# EAGLE design record_revf (EAGLE 8.5.0)
Ekho Mobile Recording Front-End Board (Rev A) Provides signal conditioning, amplification, and adjustment for the I-V Controller.
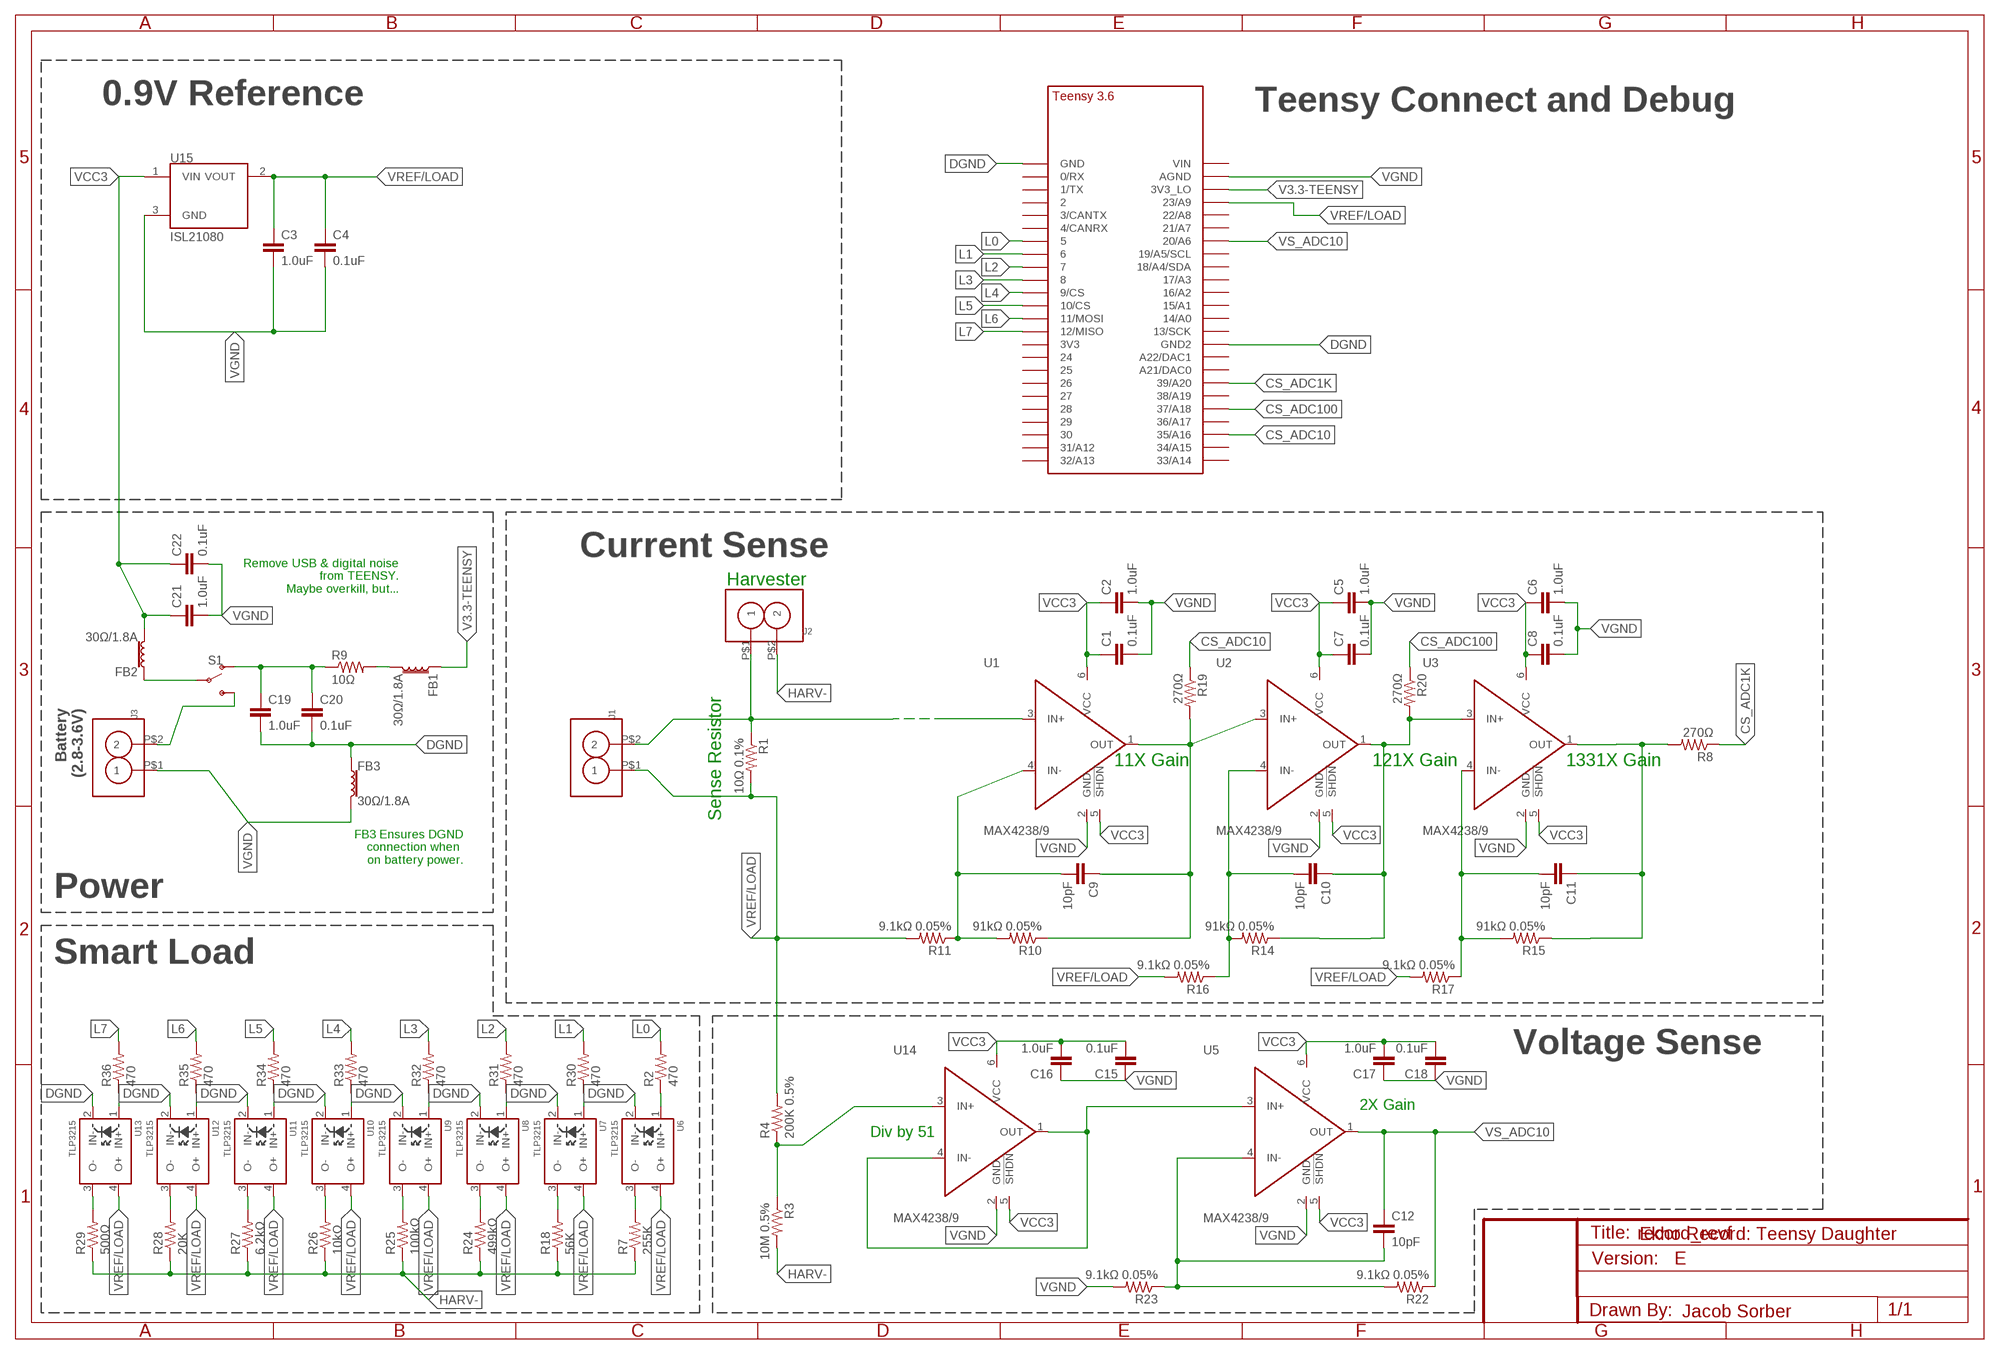
[diagram p0: schematic, sheet 1]

## Parts
C1  0.1uF  C-EU0603  [0603]
C2  1.0uF  C-EU0603  [0603]
C3  1.0uF  C-EU0603  [0603]
C4  0.1uF  C-EU0603  [0603]
C5  1.0uF  C-EU0603  [0603]
C6  1.0uF  C-EU0603  [0603]
C7  0.1uF  C-EU0603  [0603]
C8  0.1uF  C-EU0603  [0603]
C9  10pF  C-EU0603  [0603]
C10  10pF  C-EU0603  [0603]
C11  10pF  C-EU0603  [0603]
C12  10pF  C-EU0603  [0603]
C15  0.1uF  C-EU0603  [0603]
C16  1.0uF  C-EU0603  [0603]
C17  1.0uF  C-EU0603  [0603]
C18  0.1uF  C-EU0603  [0603]
C19  1.0uF  C-EU0603  [0603]
C20  0.1uF  C-EU0603  [0603]
C21  1.0uF  C-EU0603  [0603]
C22  0.1uF  C-EU0603  [0603]
FB1  30Ω/1.8A  FERRITE_BEAD-0603  [0603]
FB2  30Ω/1.8A  FERRITE_BEAD-0603  [0603]
FB3  30Ω/1.8A  FERRITE_BEAD-0603  [0603]
J1  SCREW_CONNECTOR-2PIN'  [SCREW_CONNECTOR-2PIN-3.5MM]
J2  SCREW_CONNECTOR-2PIN'  [SCREW_CONNECTOR-2PIN-3.5MM]
J3  SCREW_CONNECTOR-2PIN'  [SCREW_CONNECTOR-2PIN-3.5MM]
R1  10Ω 0.1%  RESISTOR0805-RES  [0805]
R2  470  R-EU0603  [0603]
R3  10M 0.5%  R-EU0603  [0603]
R4  200K 0.5%  R-EU0603  [0603]
R7  255K  R-EU0603  [0603]
R8  270Ω  R-EU0603  [0603]
R9  10Ω  RESISTOR0805-RES  [0805]
R10  91kΩ 0.05%  R-EU0603  [0603]
R11  9.1kΩ 0.05%  R-EU0603  [0603]
R14  91kΩ 0.05%  R-EU0603  [0603]
R15  91kΩ 0.05%  R-EU0603  [0603]
R16  9.1kΩ 0.05%  R-EU0603  [0603]
R17  9.1kΩ 0.05%  R-EU0603  [0603]
R18  56K  R-EU0603  [0603]
R19  270Ω  R-EU0603  [0603]
R20  270Ω  R-EU0603  [0603]
R22  9.1kΩ 0.05%  R-EU0603  [0603]
R23  9.1kΩ 0.05%  R-EU0603  [0603]
R24  499kΩ  R-EU0603  [0603]
R25  100kΩ  R-EU0603  [0603]
R26  10kΩ  R-EU0603  [0603]
R27  6.2kΩ  R-EU0603  [0603]
R28  20K  R-EU0603  [0603]
R29  500Ω  R-EU0603  [0603]
R30  470  R-EU0603  [0603]
R31  470  R-EU0603  [0603]
R32  470  R-EU0603  [0603]
R33  470  R-EU0603  [0603]
R34  470  R-EU0603  [0603]
R35  470  R-EU0603  [0603]
R36  470  R-EU0603  [0603]
S1  SWITCH-SPDT-PTH-11.6X4.0MM-KIT  [SWITCH_SPDT_PTH_11.6X4.0MM_KIT]
U1  MAX4238/9  [SOT23-6]
U2  MAX4238/9  [SOT23-6]
U3  MAX4238/9  [SOT23-6]
U5  MAX4238/9  [SOT23-6]
U6  TLP3215  [TLP3215]
U7  TLP3215  [TLP3215]
U8  TLP3215  [TLP3215]
U9  TLP3215  [TLP3215]
U10  TLP3215  [TLP3215]
U11  TLP3215  [TLP3215]
U12  TLP3215  [TLP3215]
U13  TLP3215  [TLP3215]
U14  MAX4238/9  [SOT23-6]
U15  ISL21080  [SOT-23]
U$6  TEENSY_3.5/3.6_SIDE_ONLY  [TEENSY_3.5/3.6_SIDE_ONLY]

## Nets
CS_ADC1K: R8.1 U$6.39/A20
CS_ADC10: R19.1 U$6.35/A16
CS_ADC100: R20.1 U$6.37/A18
DGND: C19.2 C20.2 FB3.1 U6.2(IN-) U7.2(IN-) U8.2(IN-) U9.2(IN-) U10.2(IN-) U11.2(IN-) U12.2(IN-) U13.2(IN-) U$6.GND U$6.GND2
HARV+: J1.P$2 J2.P$1 R1.1 U1.3(IN+)
HARV-: J2.P$2 R3.2 R7.1 R18.1 R24.1 R25.1 R26.1 R27.1 R28.1 R29.1
L0: R2.2 U$6.5
L1: R30.2 U$6.6
L2: R31.2 U$6.7
L3: R32.2 U$6.8
L4: R33.2 U$6.9/CS
L5: R34.2 U$6.10/CS
L6: R35.2 U$6.11/MOSI
L7: R36.2 U$6.12/MISO
N$1: C9.2 R10.2 R11.1 U1.4(IN-)
N$2: R3.1 R4.1 U14.3(IN+)
N$4: U5.3(IN+) U14.1(OUT) U14.4(IN-)
N$6: C19.1 C20.1 R9.1 S1.1(O)
N$7: FB1.2 R9.2
N$9: R29.2 U13.3(O-)
N$10: J3.P$2 S1.3(S)
N$11: C12.2 R22.2 R23.1 U5.4(IN-)
N$13: FB2.1 S1.2(P)
N$14: R28.2 U12.3(O-)
N$16: R27.2 U11.3(O-)
N$18: C10.2 R14.2 R16.1 U2.4(IN-)
N$19: C11.2 R15.2 R17.1 U3.4(IN-)
N$21: R26.2 U10.3(O-)
N$24: R25.2 U9.3(O-)
N$25: R24.2 U8.3(O-)
N$26: R18.2 U7.3(O-)
N$27: R7.2 U6.3(O-)
N$28: R2.1 U6.1(IN+)
N$29: R30.1 U7.1(IN+)
N$30: R31.1 U8.1(IN+)
N$31: R32.1 U9.1(IN+)
N$32: R33.1 U10.1(IN+)
N$33: R34.1 U11.1(IN+)
N$34: R35.1 U12.1(IN+)
N$35: R36.1 U13.1(IN+)
OUT1K: C11.1 R8.2 R15.1 U3.1(OUT)
OUT10: C9.1 R10.1 R19.2 U1.1(OUT) U2.3(IN+)
OUT100: C10.1 R14.1 R20.2 U2.1(OUT) U3.3(IN+)
V3.3-TEENSY: FB1.1 U$6.3V3_LO
VCC3: C1.1 C2.1 C5.1 C6.1 C7.1 C8.1 C15.2 C16.2 C17.2 C18.2 C21.1 C22.1 FB2.2 U1.5(!SHDN) U1.6(VCC) U2.5(!SHDN) U2.6(VCC) U3.5(!SHDN) U3.6(VCC) U5.5(!SHDN) U5.6(VCC) U14.5(!SHDN) U14.6(VCC) U15.1(VIN)
VGND: C1.2 C2.2 C3.2 C4.2 C5.2 C6.2 C7.2 C8.2 C15.1 C16.1 C17.1 C18.1 C21.2 C22.2 FB3.2 J3.P$1 R23.2 U1.2(GND) U2.2(GND) U3.2(GND) U5.2(GND) U14.2(GND) U15.3(GND) U$6.AGND
VREF/LOAD: C3.1 C4.1 J1.P$1 R1.2 R4.2 R11.2 R16.2 R17.2 U6.4(O+) U7.4(O+) U8.4(O+) U9.4(O+) U10.4(O+) U11.4(O+) U12.4(O+) U13.4(O+) U15.2(VOUT) U$6.23/A9
VS_ADC10: C12.1 R22.1 U5.1(OUT) U$6.20/A6
Unconnected: U$6.0/RX U$6.1/TX U$6.2 U$6.3/CANTX U$6.3V3 U$6.4/CANRX U$6.13/SCK U$6.14/A0 U$6.15/A1 U$6.16/A2 U$6.17/A3 U$6.18/A4/SDA U$6.19/A5/SCL U$6.21/A7 U$6.21/DAC0(A21/DAC0) U$6.22/A8 U$6.24 U$6.25 U$6.26 U$6.27 U$6.28 U$6.29 U$6.30 U$6.31/A12 U$6.32/A13 U$6.33/A14 U$6.34/A15 U$6.36/A17 U$6.38/A19 U$6.A22/DAC1 U$6.VIN

## Notes on the sheet
- 0.9V Reference
- Teensy Connect and Debug
- Current Sense
- Remove USB & digital noise
  from TEENSY.
  Maybe overkill, but...
- Harvester
- Battery
  (2.8-3.6V)
- 11X Gain | 121X Gain | 1331X Gain
- Sense Resistor
- FB3 Ensures DGND
  connection when 
  on battery power.
- Power
- Smart Load
- Voltage Sense
- 2X Gain
- Div by 51
- Ekho Record: Teensy Daughter
- E
- Jacob Sorber

## Library data of the parts
C1 C4 C7-C12 C15 C18 C20 C22 = tiny_passives:C-EU; DIGIKEY: 490-3271-1-ND
C2 C3 C5 C6 C16 C17 C19 C21 = tiny_passives:C-EU; DIGIKEY: 490-3890-1-ND
FB1-FB3 = SparkFun-Coils:FERRITE_BEAD: Ferrite Bead (blocks, cores, rings, chokes, etc.) Inductor with layers of ferrite used to suppress high frequencies. Often used to isolate high frequency noise. SparkFun Products: IOIO-OTG - V2.2 <https://www.sparkfun.com/products/13613> SparkFun SAMD21 Mini Breakout <https://www.sparkfun.com/products/13664> SparkFun 6 Degrees of Freedom Breakout - LSM6DS3 <https://www.sparkfun.com/products/13339> SparkFun SAMD21 Dev Breakout <https://www.sparkfun.com/products/13672>; PROD_ID: NDUC-07859
J1-J3 = BaseApp:SCREW_CONNECTOR-2PIN
R1 R9 = SparkFun-Passives:RESISTOR: Resistor Basic schematic elements and footprints for 0603, 1206, and PTH resistors.
R2-R4 R7 R8 R10 R11 R14-R20 R22-R36 = tiny_passives:R-EU; DIGIKEY: P2.0MJCT-ND
S1 = SparkFun-Switches:SWITCH-SPDT: Single Pole, Double Throw (SPDT) Switch Single-pole, double-throw (SPDT) switch. Variant Overview SMD-AYZ0202 Surface Mount DPDT Switch <https://www.sparkfun.com/products/597> (COM-00597) Used on e.g. LilyPad Arduino USB - ATmega32U4 Board <https://www.sparkfun.com/products/12049> PTH-11.6X4.0MM SPDT Mini Power Switch <https://www.sparkfun.com/products/102> (COM-00102) Used on e.g. SparkFun Simon Says - Through-Hole Soldering Kit <https://www.sparkfun.com/products/10547> (KIT-10547) PTH-11.6X4.0MM-KIT KIT version of SPDT Mini Power Switch - Simplifies soldering by removing tStop of switch pins - only one side can be soldered. PTH-11.6X4.0MM-LOCK LOCK version of SPDT Mini Power Switch - Offset pins hold switch in place for easier soldering. SMD-RIGHT-ANGLE Surface Mount Right Angle Switch <https://www.sparkfun.com/products/10860> (COM-10860) Used on e.g. SparkFun ESP8266 Thing <https://www.sparkfun.com/products/13231>; PROD_ID: SWCH-08261; SF_SKU: COM-00102
U1-U3 U5 U14 = misc:MAX4238/9
U6-U13 = misc:TLP3215
U15 = isl21080:ISL21080: Intersil: ISL21080, 300nA NanoPower Voltage References The ISL21080 analog voltage references feature low supply voltage operation at ultra-low 310nA typ, 1.5µA max operating current. Additionally, the ISL21080 family features guaranteed initial accuracy as low as ±0.2% and 50ppm/°C temperature coefficient. These references are ideal for general purpose portable applications to extend battery life at lower cost. The ISL21080 is provided in the industry standard 3 Ld SOT-23 pinout. The ISL21080 output voltages can be used as precision voltage sources for voltage monitors, control loops, standby voltages for low power states for DSP, FPGA, Datapath Controllers, microcontrollers and other core voltages: 0.9V, 1.024V, 1.25V, 1.5V, 2.048V, 2.5V, 3.0V, 3.3V, 4.096V and 5.0V. Special Note: Post-assembly x-ray inspection may lead to permanent changes in device output voltage and should be minimized or avoided. For further information, please see “Applications Information” on page 14 and AN1533, “X-Ray Effects on Intersil FGA References”.
U$6 = Teensy356:TEENSY_3.5/3.6_SIDE_ONLY

## Board
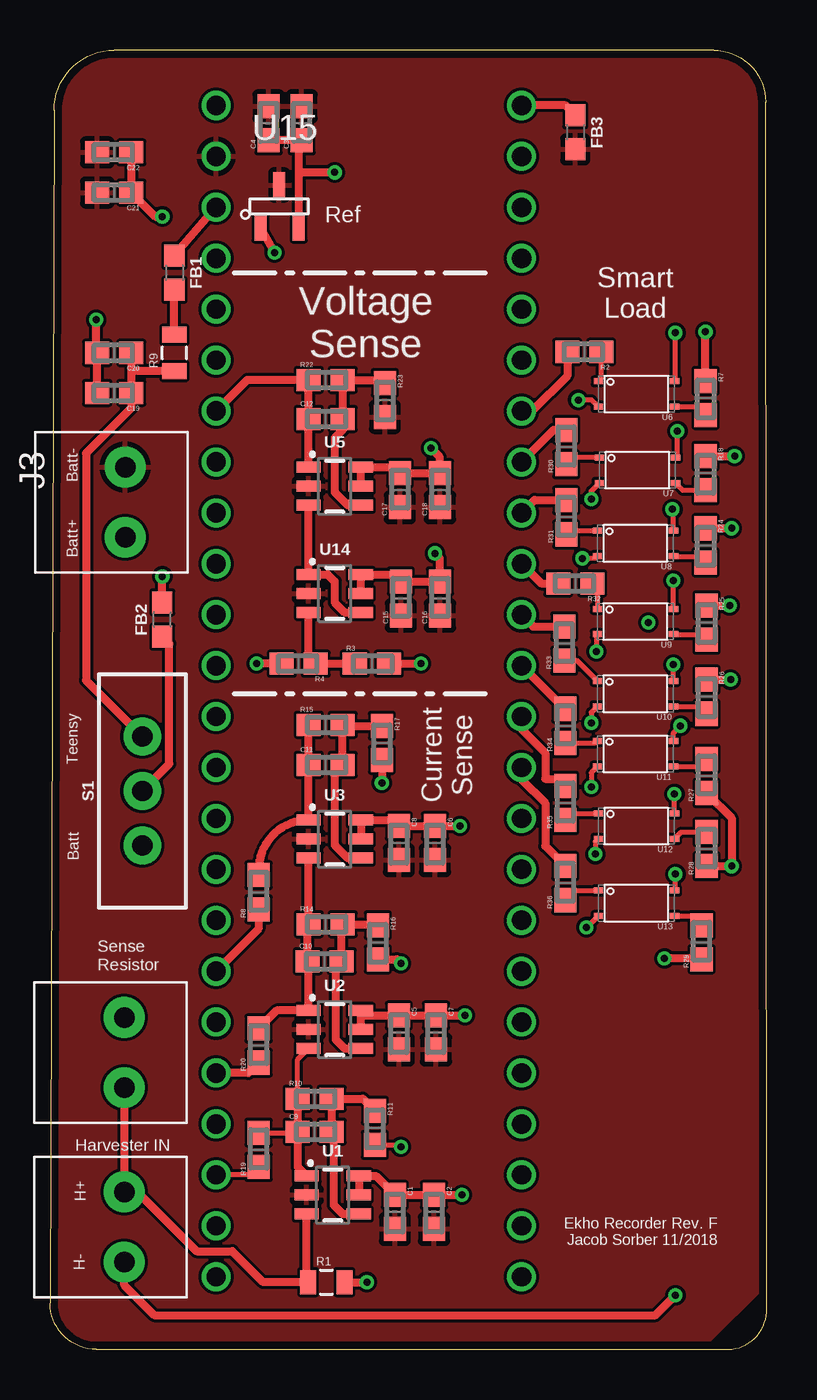
[diagram p1: board, top side]
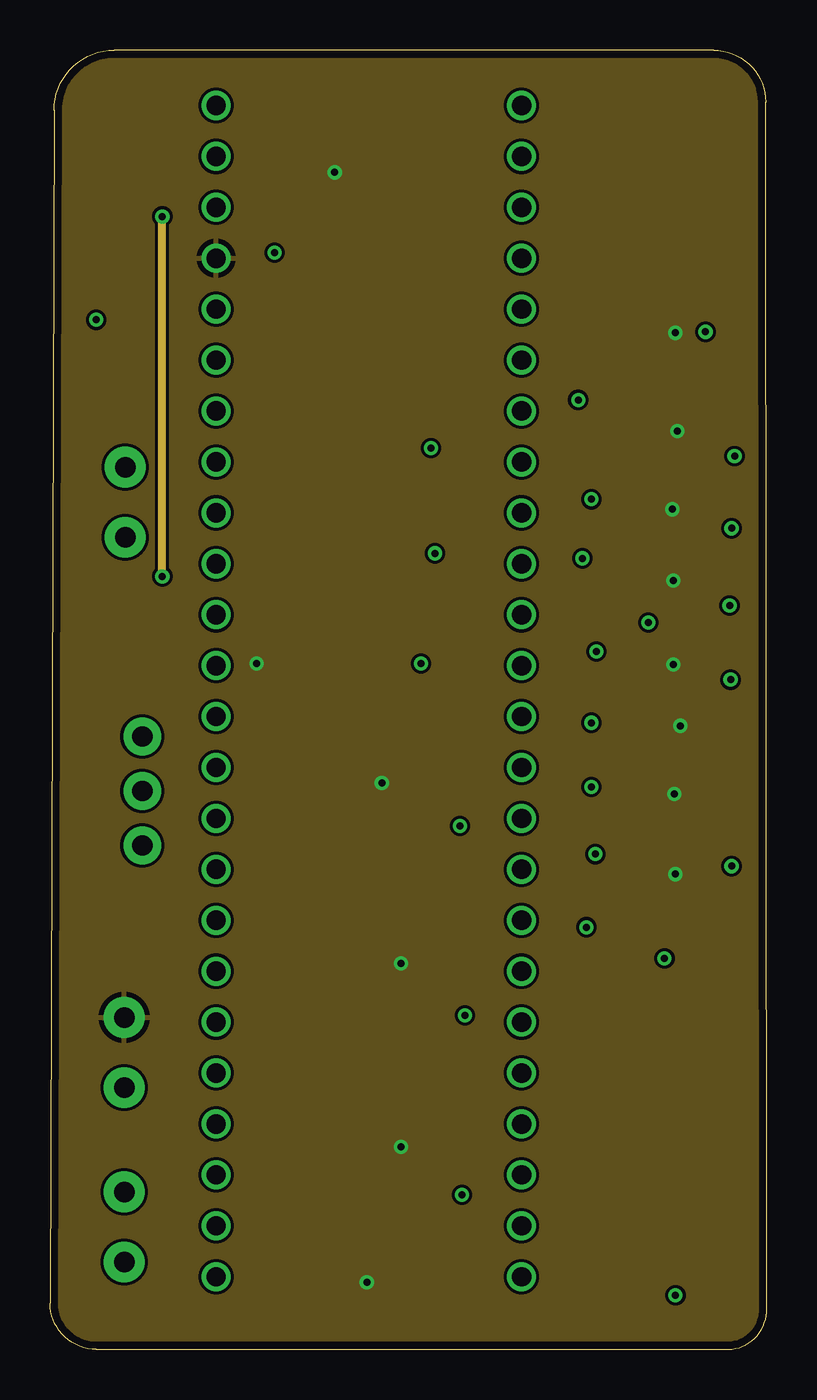
[diagram p2: board, inner layer Route2]
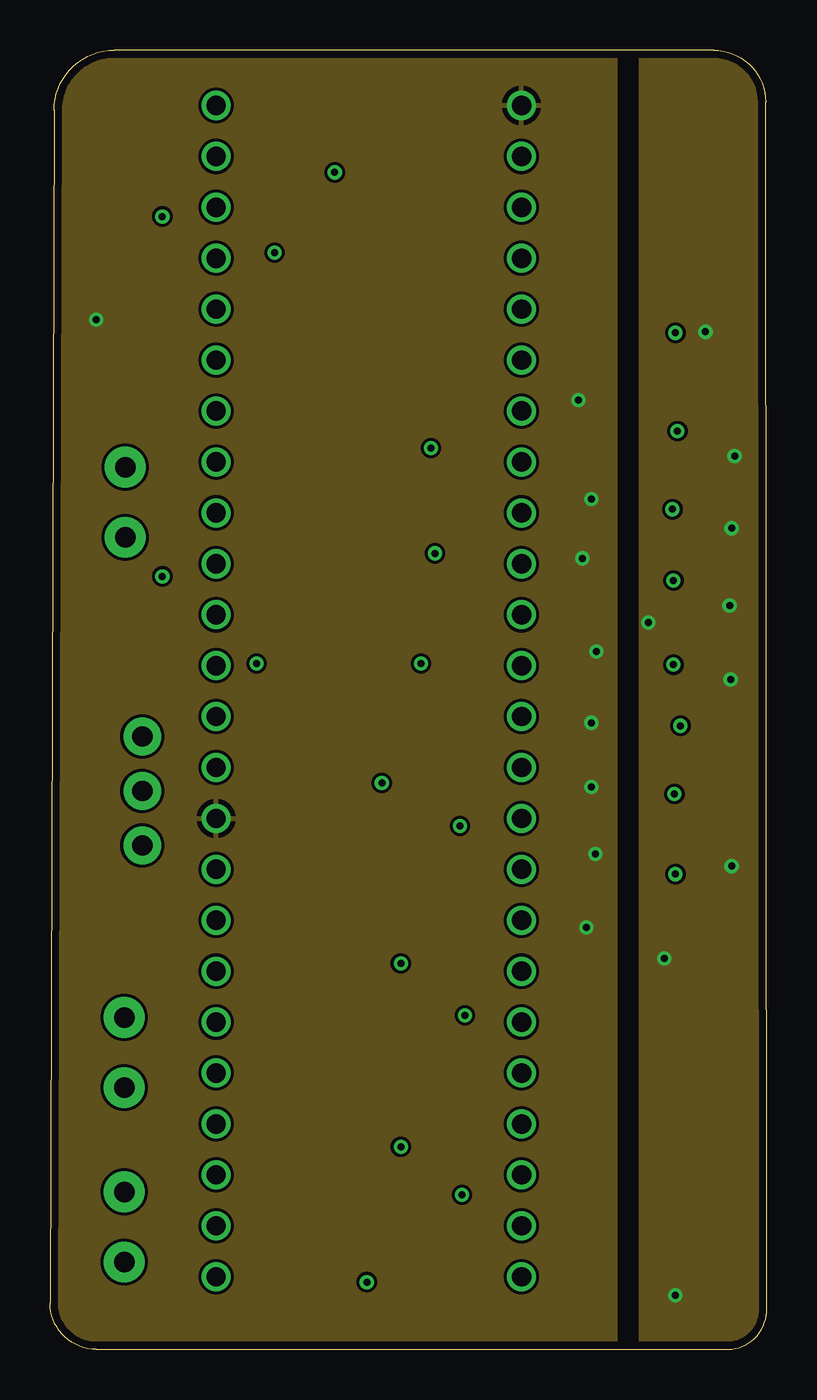
[diagram p3: board, inner layer Route15]
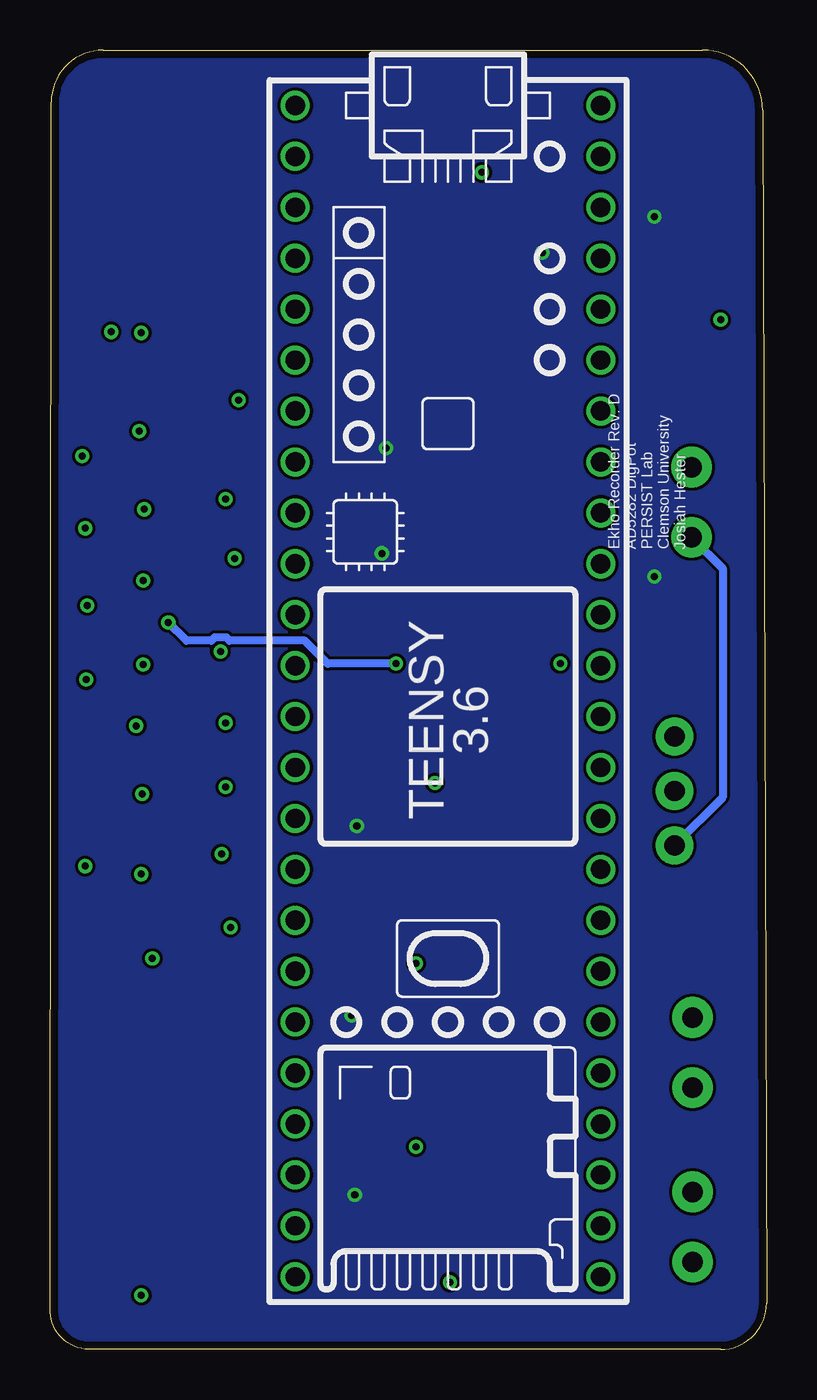
[diagram p4: board, bottom side, seen from below]

Size 35.75 x 64.8 mm. Coordinates in mm from the lower left corner, seen from the top.
Outline: 0.2,61.8 0,2.3 arc90 2.3,0 33.65,0 arc90 35.75,1.85 35.7,62.2 arc90 33.1,64.8 3.2,64.8 arc90 0.2,61.8
Copper layers (1+2+15+16): Top 0.0356mm / dielectric 1.5011mm / Route2 0.0356mm / dielectric 0.1499mm / Route15 0.0356mm / dielectric 0.2007mm / Bottom 0.0356mm
Design rules "LaenPCBOrder *": minimum track width 6mil, minimum drill 13mil, track to track 6mil, track to pad 6mil, pad to pad 6mil, via to via 6mil, smd to smd 6mil, copper to edge 15mil, drill to drill 6mil, minimum pad ring 7mil, minimum via ring 7mil, stop-mask expansion 3mil, vias tented up to drill 0mil, thermal gap 10mil

### Footprints (pad centres in the part's own frame; a part is rotated, then mirrored left to right if it is on the bottom)
0603 = smd 1.2 x 1.1: 1 -0.85,0; 2 0.85,0
0603' = smd 1.1 x 1: 1 -0.85,0; 2 0.85,0
SCREW_CONNECTOR-2PIN-3.5MM = drill 1.016 pad 2.032: P$1 -1.75,0; P$2 1.75,0
0805 = smd 0.8 x 1.2: 1 -0.9,0; 2 0.9,0
SWITCH_SPDT_PTH_11.6X4.0MM_KIT = drill 1.016 pad 1.88: 1 0,2.718; 2 0,0; 3 0,-2.718
SOT23-6 = smd 0.55 x 1.2: 1 0.95,1.3; 2 0,1.3; 3 -0.95,1.3; 4 -0.95,-1.3; 5 0,-1.3; 6 0.95,-1.3
TLP3215 = smd 0.46 x 0.3: 1 1.9,-0.635; 2 1.9,0.635; 3 -1.9,0.635; 4 -1.9,-0.635
SOT-23 = smd 0.6 x 1.25: 1 -0.95,-1.075; 2 0.95,-1.075; 3 -0.025,1.075
TEENSY_3.5/3.6_SIDE_ONLY = drill 0.965: 0/RX -25.4,-7.62; 1/TX -22.86,-7.62; 2 -20.32,-7.62; 3/CANTX -17.78,-7.62; 3V3 7.62,-7.62; 3V3_LO -22.86,7.62; 4/CANRX -15.24,-7.62; 5 -12.7,-7.62; 6 -10.16,-7.62; 7 -7.62,-7.62; 8 -5.08,-7.62; 9/CS -2.54,-7.62; 10/CS 0,-7.62; 11/MOSI 2.54,-7.62; 12/MISO 5.08,-7.62; 13/SCK 5.08,7.62; 14/A0 2.54,7.62; 15/A1 0,7.62; 16/A2 -2.54,7.62; 17/A3 -5.08,7.62; 18/A4/SDA -7.62,7.62; 19/A5/SCL -10.16,7.62; 20/A6 -12.7,7.62; 21/A7 -15.24,7.62; 21/DAC0 12.7,7.62; 22/A8 -17.78,7.62; 23/A9 -20.32,7.62; 24 10.16,-7.62; 25 12.7,-7.62; 26 15.24,-7.62; 27 17.78,-7.62; 28 20.32,-7.62; 29 22.86,-7.62; 30 25.4,-7.62; 31/A12 27.94,-7.62; 32/A13 30.48,-7.62; 33/A14 30.48,7.62; 34/A15 27.94,7.62; 35/A16 25.4,7.62; 36/A17 22.86,7.62; 37/A18 20.32,7.62; 38/A19 17.78,7.62; 39/A20 15.24,7.62; A22/DAC1 10.16,7.62; AGND -25.4,7.62; GND -27.94,-7.62; GND2 7.62,7.62; VIN -27.94,7.62

### Placement (x,y rotation side)
C1  17.2,6.85 270 top
C2  19.15,6.85 270 top
C3  12.55,61.15 90 top
C4  10.9,61.15 90 top
C5  17.4,15.8 270 top
C6  19.2,25.25 270 top
C7  19.25,15.8 270 top
C8  17.4,25.25 270 top
C9  13.2,10.85 0 top
C10  13.7,19.35 0 top
C11  13.75,29.15 0 top
C12  13.75,46.4 0 top
C15  17.5,37.45 90 top
C16  19.45,37.45 90 top
C17  17.45,42.85 90 top
C18  19.45,42.85 90 top
C19  3.2,47.7 180 top
C20  3.2,49.7 180 top
C21  3.2,57.7 180 top
C22  3.2,59.7 180 top
FB1  30Ω/1.8A  [0603']  6.2,53.7 270 top
FB2  30Ω/1.8A  [0603']  5.6,36.4 90 top
FB3  30Ω/1.8A  [0603']  26.2,60.7 270 top
J1  3.7,14.8 270 top
J2  3.7,6.1 270 top
J3  3.75,42.25 270 top
R1  13.78,3.35 0 top
R2  26.65,49.75 180 top
R3  16.05,34.2 0 top
R4  12.4,34.2 180 top
R7  32.7,47.45 270 top
R8  10.4,22.8 90 top
R9  6.2,49.7 90 top
R10  13.2,12.5 0 top
R11  16.2,11.05 270 top
R14  13.75,21.2 0 top
R15  13.75,31.15 0 top
R16  16.35,20.3 270 top
R17  16.55,30.25 270 top
R18  32.7,43.7 270 top
R19  10.4,9.95 90 top
R20  10.4,15.15 90 top
R22  13.75,48.35 0 top
R23  16.7,47.35 270 top
R24  32.7,40.1 270 top
R25  32.75,36.25 270 top
R26  32.75,32.55 270 top
R27  32.75,28.6 90 top
R28  32.75,24.95 90 top
R29  32.5,20.3 90 top
R30  25.75,45 90 top
R31  25.75,41.5 90 top
R32  26.2,38.2 180 top
R33  25.65,35.2 90 top
R34  25.7,31.1 90 top
R35  25.7,27.25 90 top
R36  25.7,23.25 90 top
S1  4.6,27.85 0 top
U1  14.1,7.7 90 top
U2  14.2,15.95 90 top
U3  14.2,25.45 90 top
U5  14.2,43.05 90 top
U6  29.25,47.65 180 top
U7  29.3,43.85 180 top
U8  29.2,40.2 180 top
U9  29.2,36.3 180 top
U10  29.2,32.7 180 top
U11  29.2,29.7 180 top
U12  29.25,26.1 180 top
U13  29.25,22.25 180 top
U14  14.2,37.7 90 top
U15  11.45,57 0 top
U$6  15.9,34.1 270 bottom

### Tracks (layer width: path | path; a pad name or v marks a point on that pad's centre or on a via)
CS_ADC1K
  Top 0.4: R8.1 10.4,20.98 U$6.39/A20
CS_ADC10
  Top 0.254: R19.1 10,8.7 U$6.35/A16
CS_ADC100
  Top 0.4: R20.1 9.88,13.78 U$6.37/A18
DGND  (via drill 0.35)
  Top 0.254: C20.2 2.3,49.75 | U6.2 27.02,47.35 v26.35,47.35 | U7.2 27,42.82 v27,42.4 | U8.2 27.18,39.45 v26.55,39.45 | U9.2 27.25,35.62 v27.25,34.8 | U10.2 27,31.77 v27,31.25 | U11.2 27,28.77 v27,28.05 | U12.2 27.2,25.32 v27.2,24.7 | U13.2 26.79,21.05 v26.75,21.05
  Top 0.4: C19.2 C20.2 | 2.3,49.75 v2.3,51.35 | FB3.1 25.71,62.04 U$6.GND
  pour Route15: 28.2,68.7 -3.8,68.7 -3.8,-3.3 28.2,-3.3
HARV+
  Top 0.254: R1.1 12.8,3.43
  Top 0.4: 12.8,3.43 U1.3 | R1.1 10.63,3.35 9.08,4.9 7.3,4.9 4.35,7.85 J2.P$1 J1.P$2
HARV-  (via drill 0.35)
  Top 0.254: R29.1 32.45,19.5
  Top 0.4: R3.2 v18.5,34.2 | R7.1 v32.7,50.75 | R18.1 v34.15,44.55 | R24.1 v34,40.95 | R25.1 v33.9,37.1 | R26.1 v33.95,33.4 | R28.1 v34,24.1 34,26.5 R27.1 | 32.45,19.5 v30.65,19.5 | J2.P$2 3.7,3.2 5.2,1.7 30.2,1.7 v31.2,2.7
  Bottom 0.4: v18.5,34.2 21.9,34.2 23.05,35.35 26.8,35.35 26.96,35.51 27.54,35.51 27.7,35.35 28.95,35.35 v29.85,36.25
  pour Route15: 29.5,68.6 39.2,68.6 39.2,0.7 35.2,-3.3 29.5,-3.3
L0
  Top 0.254: 23.54,46.82 U$6.5
  Top 0.4: 23.54,46.82 24.07,46.82 25.8,48.55 R2.2
L1
  Top 0.4: U$6.6 25.11,45.85 R30.2
L2
  Top 0.254: 25.72,42.37 R31.2
  Top 0.4: 25.72,42.37 24.17,42.37 U$6.7
L3
  Top 0.4: U$6.8 24.5,38.2 R32.2
L4
  Top 0.4: U$6.9/CS 24.11,36.05 R33.2
L5
  Top 0.254: 25.67,31.95 R34.2
  Top 0.4: U$6.10/CS 25.67,31.95
L6
  Top 0.254: 25.35,28.45 R35.2
  Top 0.4: U$6.11/MOSI 23.52,30.93 24.7,29.75 24.7,28.45 25.35,28.45
L7
  Top 0.4: U$6.12/MISO 23.52,28.43 24.7,27.25 24.7,25.1 R36.2
N$1
  Top 0.254: C9.2 14.15,10.75
  Top 0.4: C9.2 R10.2 15.6,12.5 R11.1 | 14.15,10.75 14.15,7.2 14.6,6.75 U1.4
N$2
  Top 0.254: R4.1 12.9,34.55
  Top 0.4: R4.1 R3.1 | 12.9,34.55 U14.3
N$4
  Top 0.4: U14.4 14.7,36.75 14.2,37.25 14.2,38.3 13.85,38.65 U14.1 U5.3
N$6
  Top 0.4: C20.1 4.05,48.8 | 4.05,48.8 C19.1 4.05,46.95 1.8,44.7 1.8,33.37 S1.1 | R9.1 4.05,48.8
N$7
  Top 0.4: R9.2 FB1.2
N$9
  Top 0.254: U13.3 32.04,21.62 R29.2
N$10
  Bottom 0.4: J3.P$2 2.2,38.95 2.2,27.54 S1.3
N$11
  Top 0.254: C12.2 14.6,45.85 | 14.85,42.1 U5.4 | 16.55,48.35 R23.1
  Top 0.4: C12.2 R22.2 16.55,48.35 | 14.6,45.85 14.2,45.45 14.2,42.75 14.85,42.1
N$13
  Top 0.4: S1.2 5.95,29.2 5.95,35.2 FB2.1
N$14
  Top 0.254: U12.3 31.48,25.8 R28.2
N$16
  Top 0.254: U11.3 32.37,29.07 R27.2
N$18
  Top 0.254: 16.3,21.2 R16.1 | 14.55,21.15 R14.2
  Top 0.4: R14.2 16.3,21.2 | U2.4 14.7,15 14.25,15.45 14.25,19.05 C10.2 14.55,21.15
N$19
  Top 0.254: R15.2 14.65,31.1 | C11.2 14.2,28.75 | 14.85,24.5 U3.4
  Top 0.4: 14.65,31.1 R17.1 | 14.2,28.75 14.2,25.15 14.85,24.5 | C11.2 R15.2
N$21
  Top 0.254: U10.3 32.39,32.07 R26.2
N$24
  Top 0.254: U9.3 31.11,35.65 32.5,35.65 R25.2
N$25
  Top 0.254: U8.3 31.11,39.55 32.4,39.55 R24.2
N$26
  Top 0.254: U7.3 31.57,42.85 R18.2
N$27
  Top 0.254: U6.3 32.29,47.02 R7.2
N$28
  Top 0.254: R2.1 27.5,48.44 U6.1
N$29
  Top 0.254: U7.1 26.09,44.49 R30.1
N$30
  Top 0.254: U8.1 25.93,40.84 R31.1
N$31
  Top 0.254: R32.1 27.3,37.95 U9.1
N$32
  Top 0.254: U10.1 26.29,34.35 R33.1
N$33
  Top 0.254: R34.1 27.21,30.25 U11.1
N$34
  Top 0.254: R35.1 26.04,26.74 U12.1
N$35
  Top 0.254: R36.1 26.18,22.89 U13.1
OUT1K
  Top 0.254: 10.4,23.9 R8.2 | U3.1
  Top 0.4: R15.1 C11.1 U3.1 arc90 10.4,23.9
OUT10
  Top 0.254: R19.2 12.3,10.8 C9.1 | R10.1 12.35,14.45 U2.3
  Top 0.4: R10.1 C9.1 12.35,9.1 U1.1
OUT100
  Top 0.254: 12.9,19.3 C10.1 | 12.85,21.15 R14.1 | U3.3
  Top 0.4: 12.9,19.3 U2.1 11.3,16.9 R20.2 | C10.1 12.85,21.15 | R14.1 U3.3
V3.3-TEENSY
  Top 0.4: FB1.1 U$6.3V3_LO
VCC3  (via drill 0.35)
  Top 0.254: 17.15,38.65 C15.2 | 17.15,44 C17.2
  Top 0.4: U14.5 U14.6 17.15,38.65 | C15.2 C16.2 19.45,39.45 v19.2,39.7 | U5.5 U5.6 17.15,44 | C17.2 C18.2 19.45,44.5 v19,44.95 | FB2.2 v5.6,38.55 | C22.1 C21.1 5.25,56.5 v5.6,56.5 | U15.1 v11.2,54.7 | U2.5 U2.6 15.75,16.65 C5.1 C7.1 v20.7,16.65 | v20.55,7.7 C2.1 C1.1 16.25,8.65 U1.6 U1.5 | v20.45,26.1 C6.1 C8.1 17.1,26.4 U3.6 U3.5
  Route2 0.4: v5.6,38.55 v5.6,56.5
  pour Bottom: -1.8,66.7 37.2,66.7 37.2,2.7 33.2,-1.3 32.2,-1.3 0.2,-1.3 -1.8,0.7
VGND
  pour Top: -0.8,65.7 36.15,65.7 36.15,3.65 32.2,-0.3 1.2,-0.3 -0.8,1.7
VREF/LOAD  (via drill 0.35)
  Top 0.254: v17.5,10.1 17.38,10.2 R11.2 | U6.4 31.2,48.34 v31.2,50.7 | v31.3,45.8 31.3,44.59 U7.4 | U8.4 31.1,41.9 v31.05,41.9 | U9.4 v31.1,38.35 | U10.4 v31.1,34.15 | U11.4 31.1,30.75 v31.45,31.1 | U12.4 v31.15,27.7 | U13.4 31.2,22.94 v31.2,23.7
  Top 0.4: R1.2 v15.8,3.35 | R16.2 17.3,19.45 v17.5,19.25 | R17.2 v16.55,28.25 | R4.2 v10.3,34.2 | U15.2 12.4,58.7 12.4,60.15 C3.1 C4.1
  Top 0.406: 12.4,58.7 v14.2,58.7
  pour Route2: -2.8,67.7 38.2,67.7 38.2,1.7 34.2,-2.3 -2.8,-2.3
VS_ADC10
  Top 0.254: C12.1
  Top 0.4: U5.1 C12.1 R22.1 9.83,48.35 U$6.20/A6

### Text on the board
tPlace: Ref | Smart / Load | Voltage / Sense | Batt- | Batt+ | Teensy | Current / Sense | Batt | Sense / Resistor | Harvester IN | H+ | H- | Ekho Recorder Rev. F / Jacob Sorber 11/2018
bPlace: Ekho Recorder Rev. D / AD5282 DigPot / PERSIST Lab / Clemson University / Josiah Hester